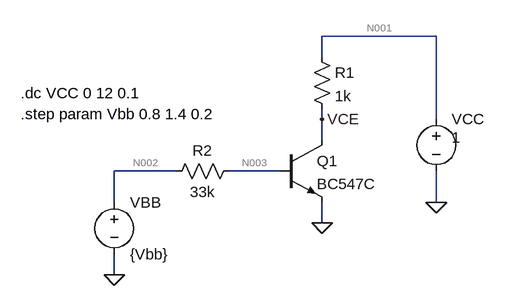
[diagram p0: schematic Sim_Transistor.asc]
Sim_Transistor.asc, the LTspice schematic file:
Version 4
SHEET 1 880 680
WIRE 400 -48 224 -48
WIRE 224 -16 224 -48
WIRE 224 80 224 64
WIRE 400 80 400 -48
WIRE 224 112 224 80
WIRE 0 160 -96 160
WIRE 160 160 80 160
WIRE -96 208 -96 160
WIRE 400 208 400 160
WIRE 224 240 224 208
WIRE -96 320 -96 288
FLAG 400 208 0
FLAG 224 80 VCE
FLAG -96 320 0
FLAG 224 240 0
SYMBOL npn 160 112 R0
SYMATTR InstName Q1
SYMATTR Value BC547C
SYMBOL res 208 -32 R0
SYMATTR InstName R1
SYMATTR Value 1k
SYMBOL voltage 400 64 R0
WINDOW 3 24 44 Left 2
WINDOW 123 0 0 Left 2
WINDOW 39 0 0 Left 2
SYMATTR Value 1
SYMATTR InstName VCC
SYMBOL voltage -96 192 R0
WINDOW 123 0 0 Left 2
WINDOW 39 0 0 Left 2
SYMATTR InstName VBB
SYMATTR Value {Vbb}
SYMBOL res 96 144 R90
WINDOW 0 0 56 VBottom 2
WINDOW 3 32 56 VTop 2
SYMATTR InstName R2
SYMATTR Value 33k
TEXT -240 40 Left 2 !.dc VCC 0 12 0.1
TEXT -240 72 Left 2 !.step param Vbb 0.8 1.4 0.2

The netlist it stands for:
* Sim_Transistor.asc
Q1 VCE N003 0 0 BC547C
R1 N001 VCE 1k
VCC N001 0 1
VBB N002 0 {Vbb}
R2 N003 N002 33k
.model NPN NPN
.model PNP PNP
.lib standard.bjt
.dc VCC 0 12 0.1
.step param Vbb 0.8 1.4 0.2
.backanno
.end

* Results of the author's LTspice run, read from the files saved beside the schematic
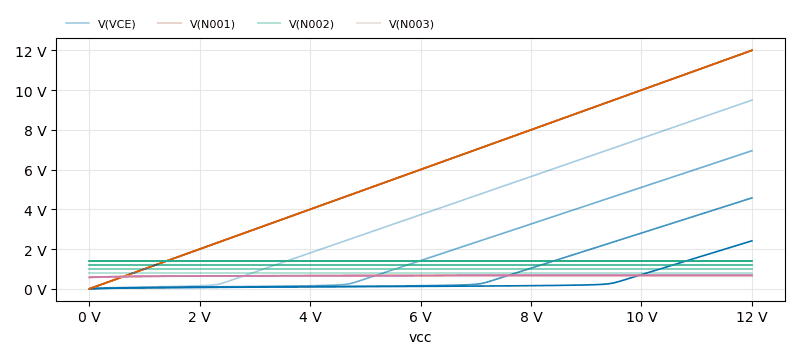
[diagram p1: DC transfer characteristic of Sim_Transistor.asc, plotted from the saved traces]
* DC transfer characteristic, 4 runs:
*   V(VCE) [vbb=0.8]: -1.302 mV at vcc=0 V, 9.494 V at vcc=12 V, min -1.302 mV, max 9.494 V
*   V(VCE) [vbb=1]: -1.638 mV at vcc=0 V, 6.946 V at vcc=12 V, min -1.638 mV, max 6.946 V
*   V(VCE) [vbb=1.2]: -1.839 mV at vcc=0 V, 4.573 V at vcc=12 V, min -1.839 mV, max 4.573 V
*   V(VCE) [vbb=1.4]: -1.977 mV at vcc=0 V, 2.411 V at vcc=12 V, min -1.977 mV, max 2.411 V
*   V(N001) [vbb=0.8]: 0 V at vcc=0 V, 12 V at vcc=12 V, min 0 V, max 12 V
*   V(N001) [vbb=1]: 0 V at vcc=0 V, 12 V at vcc=12 V, min 0 V, max 12 V
*   V(N001) [vbb=1.2]: 0 V at vcc=0 V, 12 V at vcc=12 V, min 0 V, max 12 V
*   V(N001) [vbb=1.4]: 0 V at vcc=0 V, 12 V at vcc=12 V, min 0 V, max 12 V
*   V(N002) [vbb=0.8]: 800 mV at vcc=0 V, 800 mV at vcc=12 V, min 800 mV, max 800 mV
*   V(N002) [vbb=1]: 1 V at vcc=0 V, 1 V at vcc=12 V, min 1 V, max 1 V
*   V(N002) [vbb=1.2]: 1.2 V at vcc=0 V, 1.2 V at vcc=12 V, min 1.2 V, max 1.2 V
*   V(N002) [vbb=1.4]: 1.4 V at vcc=0 V, 1.4 V at vcc=12 V, min 1.4 V, max 1.4 V
*   V(N003) [vbb=0.8]: 551.4 mV at vcc=0 V, 642.4 mV at vcc=12 V, min 551.4 mV, max 642.4 mV
*   V(N003) [vbb=1]: 566.3 mV at vcc=0 V, 663 mV at vcc=12 V, min 566.3 mV, max 663 mV
*   V(N003) [vbb=1.2]: 576.1 mV at vcc=0 V, 675.2 mV at vcc=12 V, min 576.1 mV, max 675.2 mV
*   V(N003) [vbb=1.4]: 583.3 mV at vcc=0 V, 683.9 mV at vcc=12 V, min 583.3 mV, max 683.9 mV